# EasyEDA schematic SCH_lm386_amp_2024-08-24.json
TITLE: Sheet_1; REV: 1.0; Date: 2024-08-18; Sheet: 1/1; Drawn By: kiran_satyasai; Company: Your Company
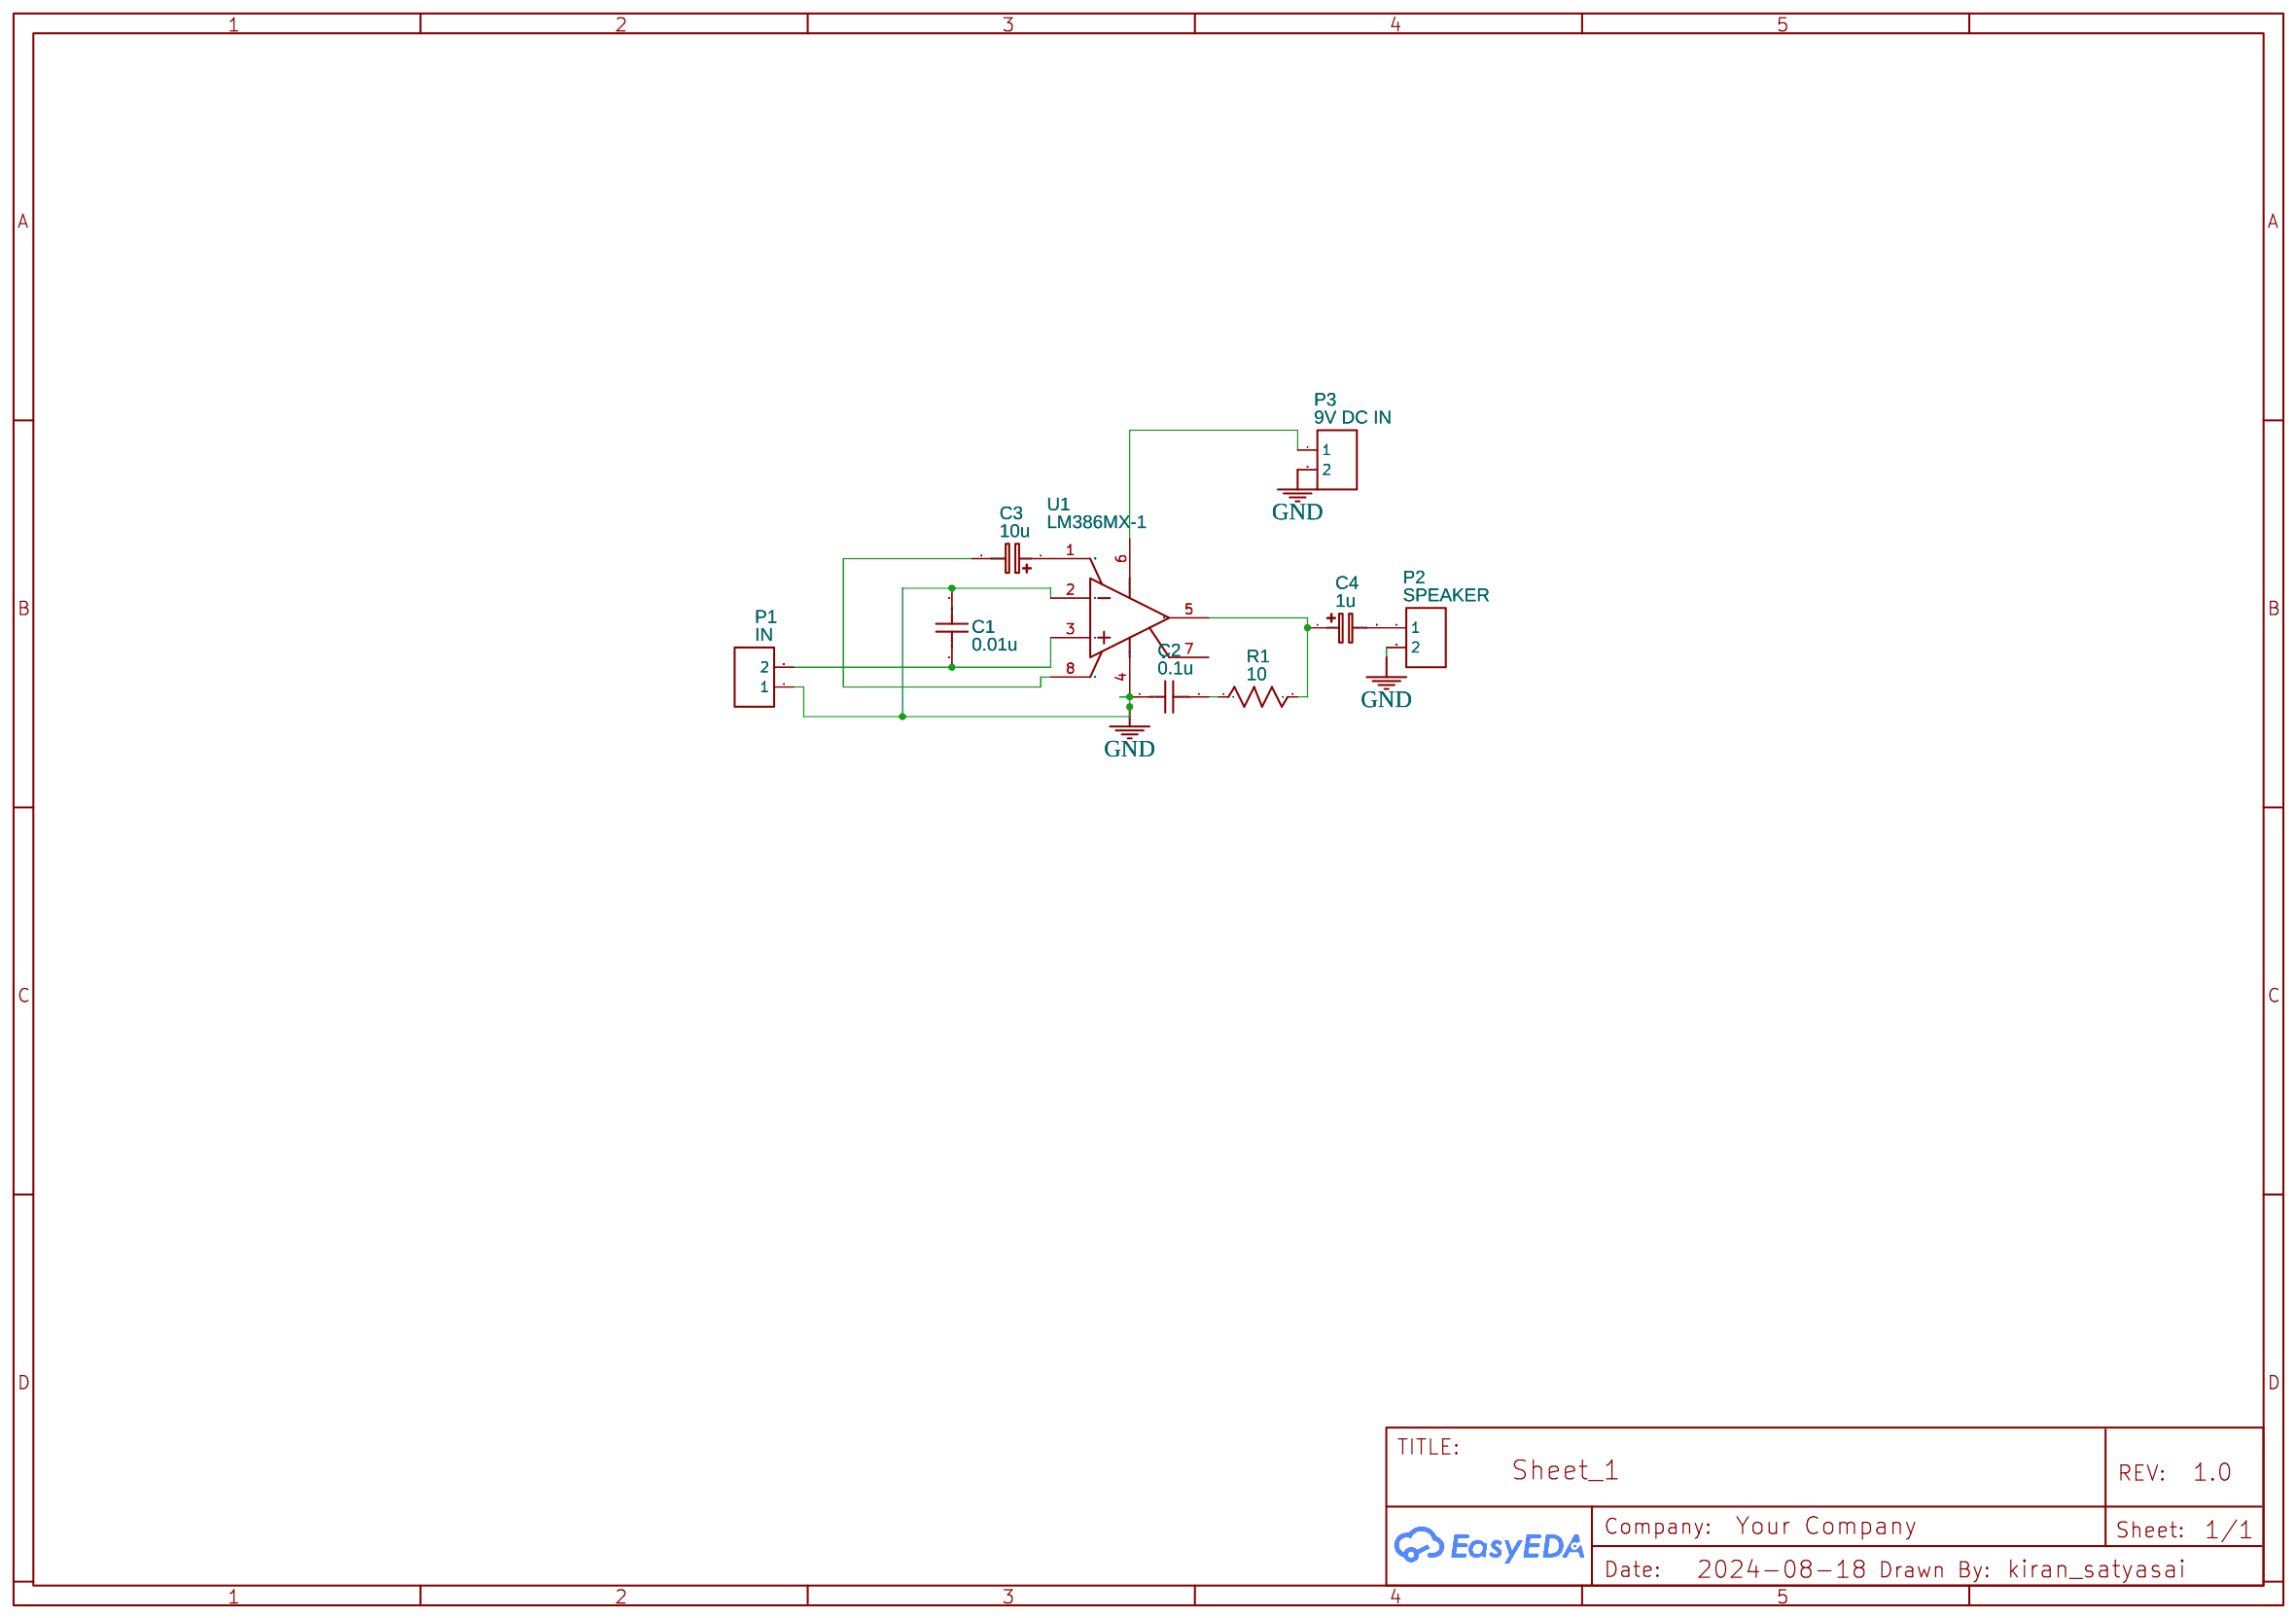
[diagram p0: schematic sheet]

## Parts
C1  0.01u  [C0603]
C2  0.1u  [C0603]
C3  10u  [CASE-A_3216]
C4  1u  [CASE-A_3216]
P1  IN  [CONN-TH_2P-P5.00]
P2  SPEAKER  [CONN-TH_2P-P5.00]
P3  9V DC IN  [CONN-TH_2P-P5.00]
R1  10  [R0603]
U1  LM386MX-1  [SOIC-8_L4.9-W3.9-P1.27-LS6.0-BL]

## Library data of the parts
C1 C2 = C_0603_US: Contributor: LCEDA_Lib
C3 C4 = C_Tan_SMD_A_EU: Contributor: LCEDA_Lib
P1-P3 = CONN-TH_2P-P5.00: Supplier: LCSC; Contributor: LCEDA_Lib
R1 = R_0603_US: Contributor: LCEDA_Lib
U1 = LM386MX-1: Contributor: LCSC; Supplier: LCSC; Supplier Part: C962965; Manufacturer: TI(德州仪器)

## Nets
GND: C1.2 C2.1 P1.1 P2.2 P3.2 U1.2(IN-) U1.4(GND)
Net-(C1-1): C1.1 P1.2 U1.3(IN+)
Net-(C2-2): C2.2 R1.1
Net-(C3-1): C3.1 U1.1(GAIN)
Net-(C3-2): C3.2 U1.8(GAIN)
Net-(C4-1): C4.1 R1.2 U1.5(VOUT)
Net-(C4-2): C4.2 P2.1
Net-(P3-1): P3.1 U1.6(VS)

Not connected (* = marked no-connect by the designer): U1 7(BYPASS)
